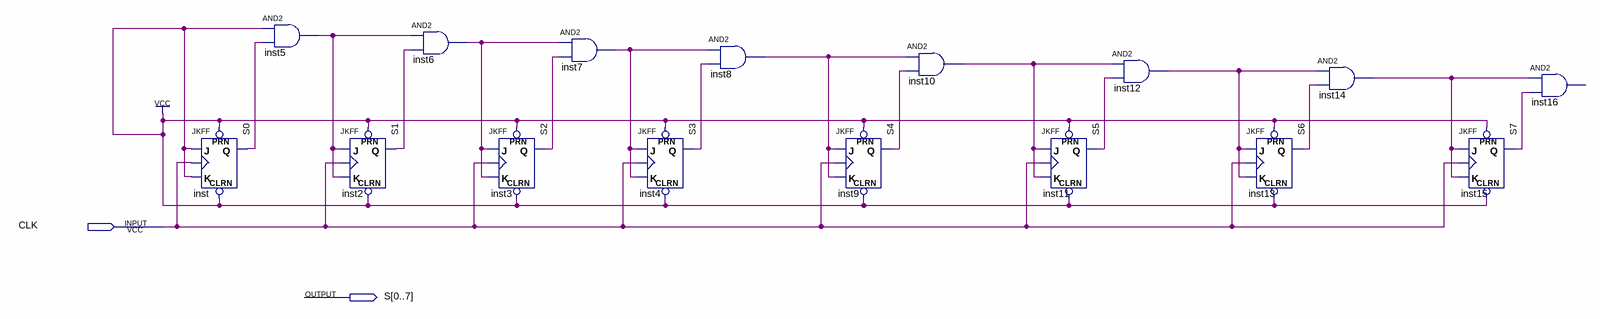
[diagram p0: schematic sheet]
// Quartus schematic countersincrono.bdf as structural Verilog: 16 symbols, 2 pins
module countersincrono (
  input  CLK,
  output [0:7] S
);

  wire inst5_out, inst6_out, inst7_out, inst8_out, inst10_out, inst12_out, inst14_out;

  JKFF inst (.PRN(1'b1), .CLRN(1'b1), .K(1'b1), .J(1'b1), .CLK(CLK), .Q(S[0]));
  and inst5 (inst5_out, 1'b1, S[0]);
  JKFF inst2 (.PRN(1'b1), .CLRN(1'b1), .K(inst5_out), .J(inst5_out), .CLK(CLK), .Q(S[1]));
  and inst6 (inst6_out, inst5_out, S[1]);
  JKFF inst3 (.PRN(1'b1), .CLRN(1'b1), .K(inst6_out), .J(inst6_out), .CLK(CLK), .Q(S[2]));
  and inst7 (inst7_out, inst6_out, S[2]);
  JKFF inst4 (.PRN(1'b1), .CLRN(1'b1), .K(inst7_out), .J(inst7_out), .CLK(CLK), .Q(S[3]));
  and inst8 (inst8_out, inst7_out, S[3]);
  JKFF inst9 (.PRN(1'b1), .CLRN(1'b1), .K(inst8_out), .J(inst8_out), .CLK(CLK), .Q(S[4]));
  and inst10 (inst10_out, inst8_out, S[4]);
  JKFF inst11 (.PRN(1'b1), .CLRN(1'b1), .K(inst10_out), .J(inst10_out), .CLK(CLK), .Q(S[5]));
  and inst12 (inst12_out, inst10_out, S[5]);
  JKFF inst13 (.PRN(1'b1), .CLRN(1'b1), .K(inst12_out), .J(inst12_out), .CLK(CLK), .Q(S[6]));
  and inst14 (inst14_out, inst12_out, S[6]);
  JKFF inst15 (.PRN(1'b1), .CLRN(1'b1), .K(inst14_out), .J(inst14_out), .CLK(CLK), .Q(S[7]));
  // AND2 inst16 has open pins: IN1=inst14_out, IN2=S[7], OUT=open
endmodule
